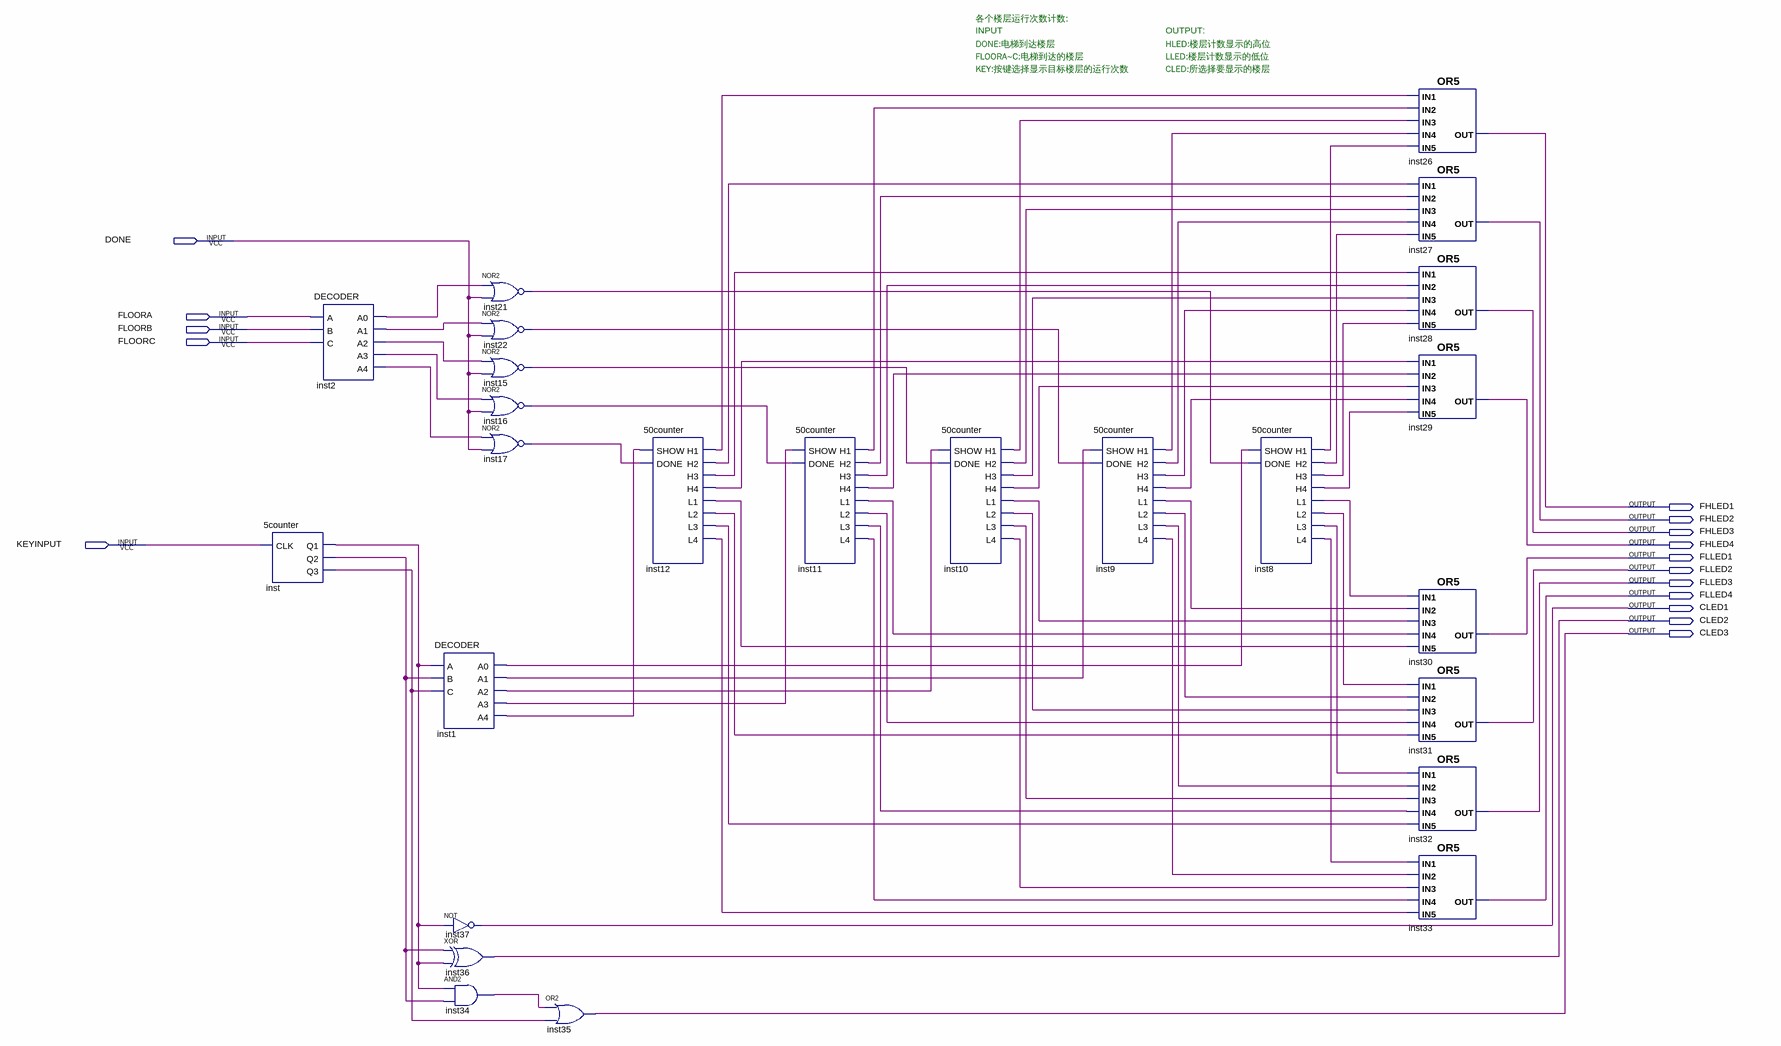
[diagram p0: schematic sheet]
// Quartus schematic floorruncount.bdf as structural Verilog: 25 symbols, 16 pins
module floorruncount (
  input  DONE,
  input  FLOORA,
  input  FLOORB,
  input  FLOORC,
  input  KEYINPUT,
  output FHLED1,
  output FHLED2,
  output FHLED3,
  output FHLED4,
  output FLLED1,
  output FLLED2,
  output FLLED3,
  output FLLED4,
  output CLED1,
  output CLED2,
  output CLED3
);

  wire inst1_a0, inst1_a1, inst1_a2, inst1_a3, inst1_a4, inst2_a0, inst2_a1, inst2_a2, inst2_a3, inst2_a4,
       inst8_h1, inst8_h2, inst8_h3, inst8_h4, inst8_l1, inst8_l2, inst8_l3, inst8_l4, inst9_h1, inst9_h2,
       inst9_h3, inst9_h4, inst9_l1, inst9_l2, inst9_l3, inst9_l4, inst10_h1, inst10_h2, inst10_h3,
       inst10_h4, inst10_l1, inst10_l2, inst10_l3, inst10_l4, inst11_h1, inst11_h2, inst11_h3, inst11_h4,
       inst11_l1, inst11_l2, inst11_l3, inst11_l4, inst12_h1, inst12_h2, inst12_h3, inst12_h4, inst12_l1,
       inst12_l2, inst12_l3, inst12_l4, inst15_out, inst16_out, inst17_out, inst21_out, inst22_out,
       inst34_out, inst_q1, inst_q2, inst_q3;

  \5counter  inst (.CLK(KEYINPUT), .Q1(inst_q1), .Q2(inst_q2), .Q3(inst_q3));
  DECODER inst2 (
    .A(FLOORA), .B(FLOORB), .C(FLOORC), .A0(inst2_a0), .A1(inst2_a1), .A2(inst2_a2), .A3(inst2_a3),
    .A4(inst2_a4));
  DECODER inst1 (
    .A(inst_q1), .B(inst_q2), .C(inst_q3), .A0(inst1_a0), .A1(inst1_a1), .A2(inst1_a2), .A3(inst1_a3),
    .A4(inst1_a4));
  not inst37 (CLED1, inst_q1);
  xor inst36 (CLED2, inst_q2, inst_q1);
  and inst34 (inst34_out, inst_q1, inst_q2);
  nor inst21 (inst21_out, inst2_a0, DONE);
  nor inst22 (inst22_out, inst2_a1, DONE);
  nor inst15 (inst15_out, inst2_a2, DONE);
  nor inst16 (inst16_out, inst2_a3, DONE);
  nor inst17 (inst17_out, inst2_a4, DONE);
  or inst35 (CLED3, inst34_out, inst_q3);
  \50counter  inst12 (
    .SHOW(inst1_a4), .DONE(inst17_out), .H1(inst12_h1), .H2(inst12_h2), .H3(inst12_h3), .H4(inst12_h4),
    .L1(inst12_l1), .L2(inst12_l2), .L3(inst12_l3), .L4(inst12_l4));
  \50counter  inst11 (
    .SHOW(inst1_a3), .DONE(inst16_out), .H1(inst11_h1), .H2(inst11_h2), .H3(inst11_h3), .H4(inst11_h4),
    .L1(inst11_l1), .L2(inst11_l2), .L3(inst11_l3), .L4(inst11_l4));
  \50counter  inst10 (
    .SHOW(inst1_a2), .DONE(inst15_out), .H1(inst10_h1), .H2(inst10_h2), .H3(inst10_h3), .H4(inst10_h4),
    .L1(inst10_l1), .L2(inst10_l2), .L3(inst10_l3), .L4(inst10_l4));
  \50counter  inst9 (
    .SHOW(inst1_a1), .DONE(inst22_out), .H1(inst9_h1), .H2(inst9_h2), .H3(inst9_h3), .H4(inst9_h4),
    .L1(inst9_l1), .L2(inst9_l2), .L3(inst9_l3), .L4(inst9_l4));
  \50counter  inst8 (
    .SHOW(inst1_a0), .DONE(inst21_out), .H1(inst8_h1), .H2(inst8_h2), .H3(inst8_h3), .H4(inst8_h4),
    .L1(inst8_l1), .L2(inst8_l2), .L3(inst8_l3), .L4(inst8_l4));
  or inst26 (FHLED1, inst12_h1, inst11_h1, inst10_h1, inst9_h1, inst8_h1);
  or inst27 (FHLED2, inst12_h2, inst11_h2, inst10_h2, inst9_h2, inst8_h2);
  or inst28 (FHLED3, inst12_h3, inst11_h3, inst10_h3, inst9_h3, inst8_h3);
  or inst29 (FHLED4, inst12_h4, inst11_h4, inst10_h4, inst9_h4, inst8_h4);
  or inst30 (FLLED1, inst8_l1, inst9_l1, inst10_l1, inst11_l1, inst12_l1);
  or inst31 (FLLED2, inst8_l2, inst9_l2, inst10_l2, inst11_l2, inst12_l2);
  or inst32 (FLLED3, inst8_l3, inst9_l3, inst10_l3, inst11_l3, inst12_l3);
  or inst33 (FLLED4, inst8_l4, inst9_l4, inst10_l4, inst11_l4, inst12_l4);

  // Notes on the sheet:
  //   各个楼层运行次数计数:
  //   INPUT
  //   OUTPUT:
  //   DONE:电梯到达楼层
  //   HLED:楼层计数显示的高位
  //   FLOORA~C:电梯到达的楼层
  //   LLED:楼层计数显示的低位
  //   KEY:按键选择显示目标楼层的运行次数
  //   CLED:所选择要显示的楼层
endmodule
